# Altium schematic sheet DC24V驱动.SchDoc
size A4
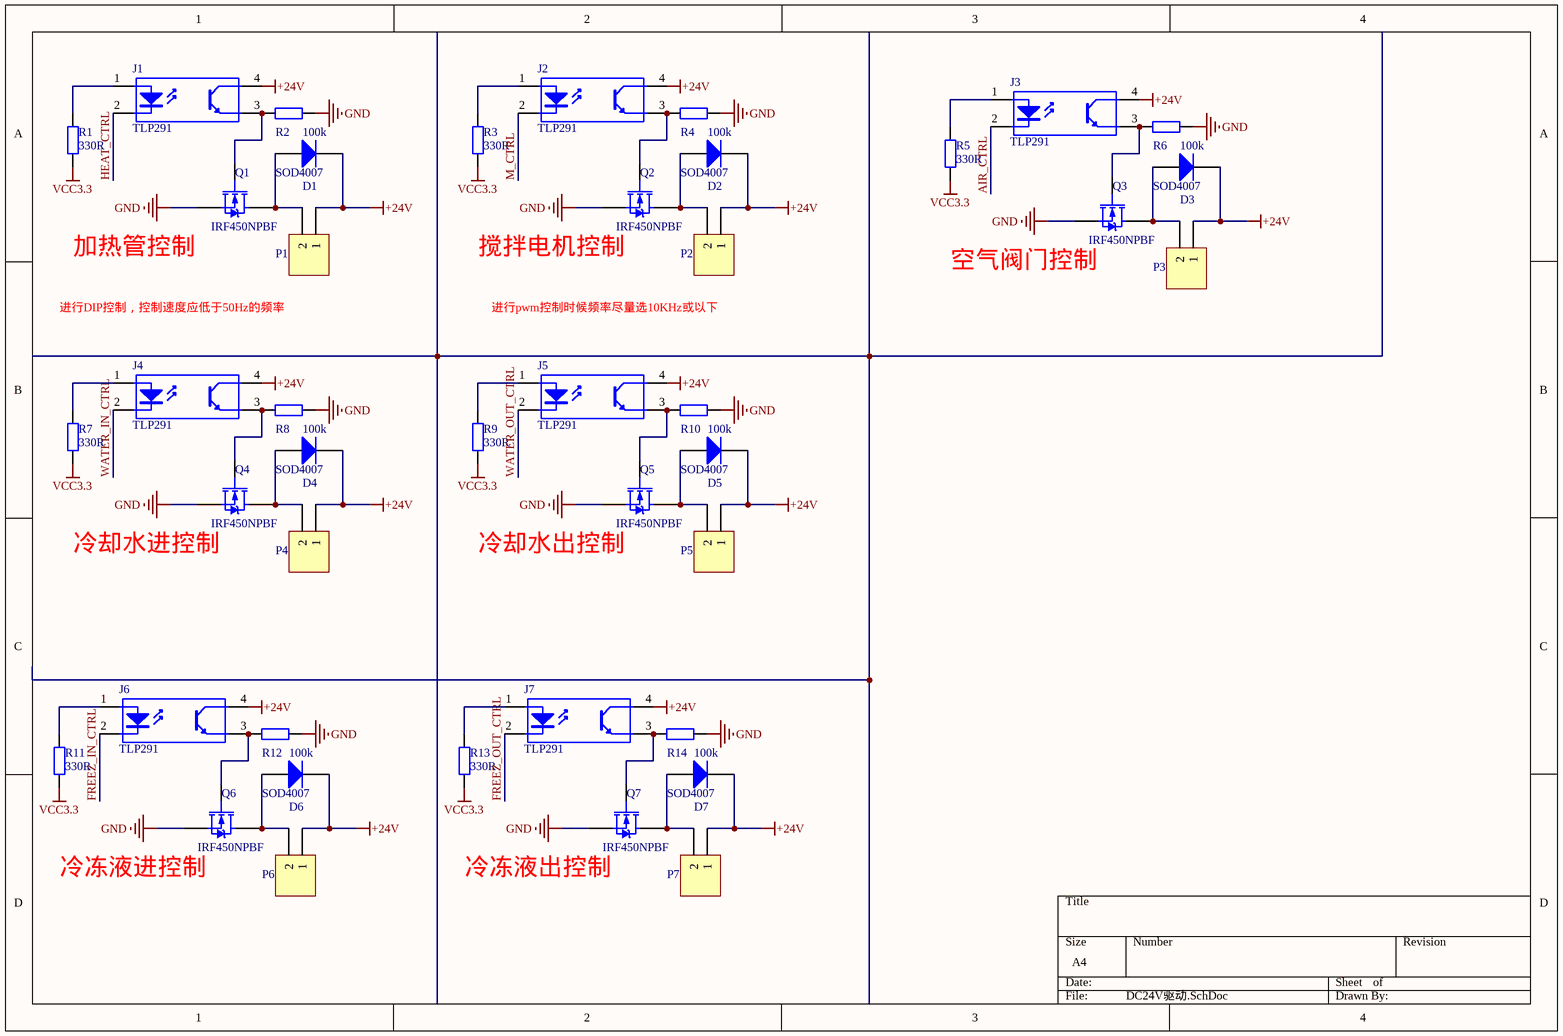
[diagram p0: DC24V驱动.SchDoc]

## Parts
D1  Type: SOD4007  [SOD123]  (hidden comment: Diode)
D2  Type: SOD4007  [SOD123]  (hidden comment: Diode)
D3  Type: SOD4007  [SOD123]  (hidden comment: Diode)
D4  Type: SOD4007  [SOD123]  (hidden comment: Diode)
D5  Type: SOD4007  [SOD123]  (hidden comment: Diode)
D6  Type: SOD4007  [SOD123]  (hidden comment: Diode)
D7  Type: SOD4007  [SOD123]  (hidden comment: Diode)
J1  TLP291  [SOP127P710X350-4N]
J2  TLP291  [SOP127P710X350-4N]
J3  TLP291  [SOP127P710X350-4N]
J4  TLP291  [SOP127P710X350-4N]
J5  TLP291  [SOP127P710X350-4N]
J6  TLP291  [SOP127P710X350-4N]
J7  TLP291  [SOP127P710X350-4N]
P1  Header 2  [HDR2X1_A]  (value not drawn)
P2  Header 2  [HDR2X1_A]  (value not drawn)
P3  Header 2  [HDR2X1_A]  (value not drawn)
P4  Header 2  [HDR2X1_A]  (value not drawn)
P5  Header 2  [HDR2X1_A]  (value not drawn)
P6  Header 2  [HDR2X1_A]  (value not drawn)
P7  Header 2  [HDR2X1_A]  (value not drawn)
Q1  IRF450NPBF  [TO-263-2]
Q2  IRF450NPBF  [TO-263-2]
Q3  IRF450NPBF  [TO-263-2]
Q4  IRF450NPBF  [TO-263-2]
Q5  IRF450NPBF  [TO-263-2]
Q6  IRF450NPBF  [TO-263-2]
Q7  IRF450NPBF  [TO-263-2]
R1  value 330R  [0603-1]  (hidden comment: Res1)
R2  value 100k  [0603-1]  (hidden comment: Res1)
R3  value 330R  [0603-1]  (hidden comment: Res1)
R4  value 100k  [0603-1]  (hidden comment: Res1)
R5  value 330R  [0603-1]  (hidden comment: Res1)
R6  value 100k  [0603-1]  (hidden comment: Res1)
R7  value 330R  [0603-1]  (hidden comment: Res1)
R8  value 100k  [0603-1]  (hidden comment: Res1)
R9  value 330R  [0603-1]  (hidden comment: Res1)
R10  value 100k  [0603-1]  (hidden comment: Res1)
R11  value 330R  [0603-1]  (hidden comment: Res1)
R12  value 100k  [0603-1]  (hidden comment: Res1)
R13  value 330R  [0603-1]  (hidden comment: Res1)
R14  value 100k  [0603-1]  (hidden comment: Res1)

## Nets
+24V: D1.2(K) D2.2(K) D3.2(K) D4.2(K) D5.2(K) D6.2(K) D7.2(K) J1.4(C) J2.4(C) J3.4(C) J4.4(C) J5.4(C) J6.4(C) J7.4(C) P1.1 P2.1 P3.1 P4.1 P5.1 P6.1 P7.1
GND: Q1.2(S) Q2.2(S) Q3.2(S) Q4.2(S) Q5.2(S) Q6.2(S) Q7.2(S) R2.1 R4.1 R6.1 R8.1 R10.1 R12.1 R14.1
VCC3.3: R1.2 R3.2 R5.2 R7.2 R9.2 R11.2 R13.2
AIR_CTRL: J3.2(K)
FREEZ_IN_CTRL: J6.2(K)
FREEZ_OUT_CTRL: J7.2(K)
HEAT_CTRL: J1.2(K)
M_CTRL: J2.2(K)
WATER_IN_CTRL: J4.2(K)
WATER_OUT_CTRL: J5.2(K)
NetD1_1: D1.1(A) P1.2 Q1.3(D)
NetD2_1: D2.1(A) P2.2 Q2.3(D)
NetD3_1: D3.1(A) P3.2 Q3.3(D)
NetD4_1: D4.1(A) P4.2 Q4.3(D)
NetD5_1: D5.1(A) P5.2 Q5.3(D)
NetD6_1: D6.1(A) P6.2 Q6.3(D)
NetD7_1: D7.1(A) P7.2 Q7.3(D)
NetJ1_1: J1.1(A) R1.1
NetJ1_3: J1.3(E) Q1.1(G) R2.2
NetJ2_1: J2.1(A) R3.1
NetJ2_3: J2.3(E) Q2.1(G) R4.2
NetJ3_1: J3.1(A) R5.1
NetJ3_3: J3.3(E) Q3.1(G) R6.2
NetJ4_1: J4.1(A) R7.1
NetJ4_3: J4.3(E) Q4.1(G) R8.2
NetJ5_1: J5.1(A) R9.1
NetJ5_3: J5.3(E) Q5.1(G) R10.2
NetJ6_1: J6.1(A) R11.1
NetJ6_3: J6.3(E) Q6.1(G) R12.2
NetJ7_1: J7.1(A) R13.1
NetJ7_3: J7.3(E) Q7.1(G) R14.2

## Notes on the sheet
- 进行DIP控制，控制速度应低于50Hz的频率
- 加热管控制
- 搅拌电机控制
- 进行pwm控制时候频率尽量选10KHz或以下
- 空气阀门控制
- 冷却水进控制
- 冷却水出控制
- 冷冻液进控制
- 冷冻液出控制

## Library data of the parts
D1-D7 = Diode: 二极管; Published: 8-Jun-2000; LatestRevisionDate: 17-Jul-2002; LatestRevisionNote: Re-released for DXP Platform.; PackageDocument: Sep-1996; PackageReference: SMC; Publisher: Altium Limited; Code_JEDEC: DO-214-AB
J1-J7 = TLP281: 光耦; Published: 24-Mar-1999; LatestRevisionDate: 04-Mar-2005; LatestRevisionNote: Sch pins 3 & 4 Swapped.; DatasheetDocument: Nov-2003; PackageReference: DIP-4; Publisher: Altium Limited
P1-P7 = Header 2: 接插件; LatestRevisionDate: 17-Jul-2002; LatestRevisionNote: Re-released for DXP Platform.; Publisher: Altium Limited
Q1-Q7 = MOSFET-N: N-Channel MOSFET; PackageDocument: 1995/1996; Published: 8-Jun-2000; LatestRevisionDate: 17-Jul-2002; LatestRevisionNote: Re-released for DXP Platform.; PackageReference: E3; Publisher: Altium Limited
R1-R14 = Res1: 贴片电阻; Published: 8-Jun-2000; LatestRevisionDate: 17-Jul-2002; LatestRevisionNote: Re-released for DXP Platform.; PackageReference: AXIAL-0.4; Publisher: Altium Limited